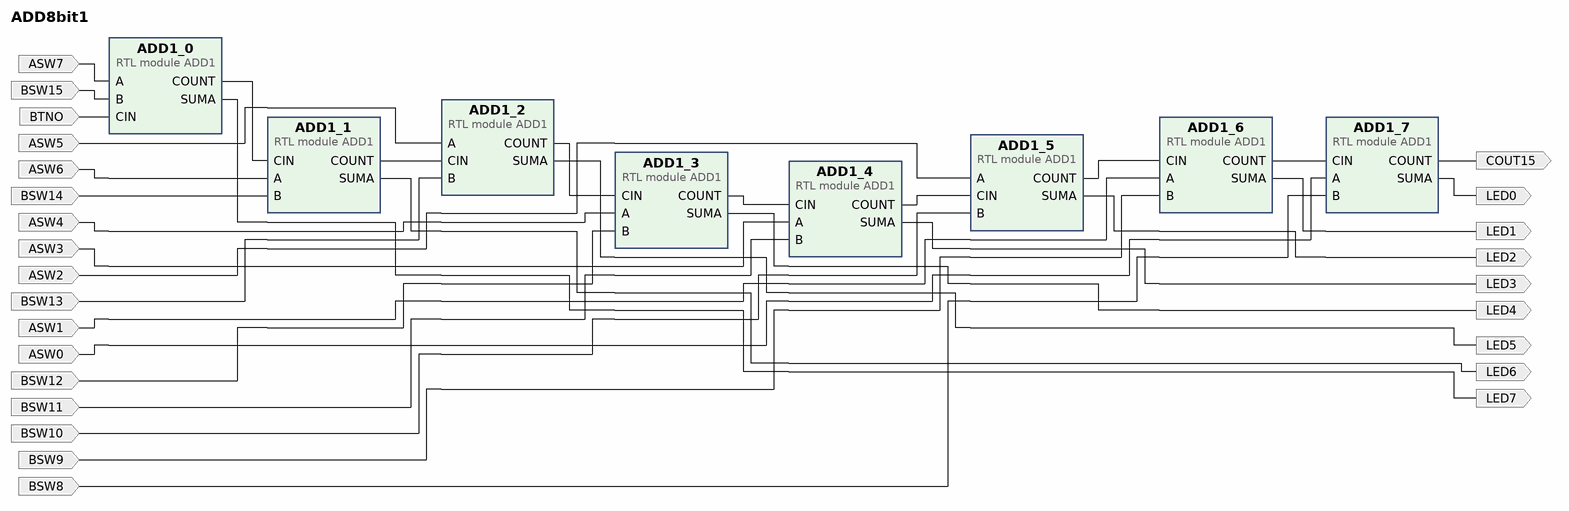
[diagram p0: block diagram of the top level]
# Vivado block design ADD8bit1, xc7a35tcpg236-1, Vivado 2020.1
create_bd_design ADD8bit1

create_bd_port -dir I ASW0
create_bd_port -dir I ASW1
create_bd_port -dir I ASW2
create_bd_port -dir I ASW3
create_bd_port -dir I ASW4
create_bd_port -dir I ASW5
create_bd_port -dir I ASW6
create_bd_port -dir I ASW7
create_bd_port -dir I BSW8
create_bd_port -dir I BSW9
create_bd_port -dir I BSW10
create_bd_port -dir I BSW11
create_bd_port -dir I BSW12
create_bd_port -dir I BSW13
create_bd_port -dir I BSW14
create_bd_port -dir I BSW15
create_bd_port -dir O LED0
create_bd_port -dir O LED1
create_bd_port -dir O LED2
create_bd_port -dir O LED3
create_bd_port -dir O LED4
create_bd_port -dir O LED5
create_bd_port -dir O LED6
create_bd_port -dir O LED7
create_bd_port -dir O COUT15
create_bd_port -dir I BTNO

create_bd_cell -type module -reference ADD1 ADD1_0
create_bd_cell -type module -reference ADD1 ADD1_1
create_bd_cell -type module -reference ADD1 ADD1_2
create_bd_cell -type module -reference ADD1 ADD1_3
create_bd_cell -type module -reference ADD1 ADD1_4
create_bd_cell -type module -reference ADD1 ADD1_5
create_bd_cell -type module -reference ADD1 ADD1_6
create_bd_cell -type module -reference ADD1 ADD1_7

# ---- connections ----

connect_bd_net -net ASW7_1 [get_bd_ports ASW7] [get_bd_pins ADD1_0/A]
connect_bd_net -net ASW6_1 [get_bd_ports ASW6] [get_bd_pins ADD1_1/A]
connect_bd_net -net ASW5_1 [get_bd_ports ASW5] [get_bd_pins ADD1_2/A]
connect_bd_net -net ASW4_1 [get_bd_ports ASW4] [get_bd_pins ADD1_3/A]
connect_bd_net -net ASW3_1 [get_bd_ports ASW3] [get_bd_pins ADD1_4/A]
connect_bd_net -net ASW2_1 [get_bd_ports ASW2] [get_bd_pins ADD1_5/A]
connect_bd_net -net ASW1_1 [get_bd_ports ASW1] [get_bd_pins ADD1_6/A]
connect_bd_net -net ASW0_1 [get_bd_ports ASW0] [get_bd_pins ADD1_7/A]
connect_bd_net -net BSW15_1 [get_bd_ports BSW15] [get_bd_pins ADD1_0/B]
connect_bd_net -net BSW14_1 [get_bd_ports BSW14] [get_bd_pins ADD1_1/B]
connect_bd_net [get_bd_pins ADD1_0/COUNT] [get_bd_pins ADD1_1/CIN]
connect_bd_net -net BSW13_1 [get_bd_ports BSW13] [get_bd_pins ADD1_2/B]
connect_bd_net -net BSW12_1 [get_bd_ports BSW12] [get_bd_pins ADD1_3/B]
connect_bd_net -net BSW11_1 [get_bd_ports BSW11] [get_bd_pins ADD1_4/B]
connect_bd_net -net BSW10_1 [get_bd_ports BSW10] [get_bd_pins ADD1_5/B]
connect_bd_net -net BSW9_1 [get_bd_ports BSW9] [get_bd_pins ADD1_6/B]
connect_bd_net -net BSW8_1 [get_bd_ports BSW8] [get_bd_pins ADD1_7/B]
connect_bd_net [get_bd_pins ADD1_7/SUMA] [get_bd_ports LED0]
connect_bd_net [get_bd_pins ADD1_6/COUNT] [get_bd_pins ADD1_7/CIN]
connect_bd_net [get_bd_pins ADD1_5/COUNT] [get_bd_pins ADD1_6/CIN]
connect_bd_net [get_bd_pins ADD1_1/COUNT] [get_bd_pins ADD1_2/CIN]
connect_bd_net [get_bd_pins ADD1_2/COUNT] [get_bd_pins ADD1_3/CIN]
connect_bd_net [get_bd_pins ADD1_3/COUNT] [get_bd_pins ADD1_4/CIN]
connect_bd_net [get_bd_pins ADD1_4/COUNT] [get_bd_pins ADD1_5/CIN]
connect_bd_net [get_bd_pins ADD1_6/SUMA] [get_bd_ports LED1]
connect_bd_net [get_bd_pins ADD1_5/SUMA] [get_bd_ports LED2]
connect_bd_net [get_bd_pins ADD1_4/SUMA] [get_bd_ports LED3]
connect_bd_net [get_bd_pins ADD1_3/SUMA] [get_bd_ports LED4]
connect_bd_net [get_bd_pins ADD1_2/SUMA] [get_bd_ports LED5]
connect_bd_net [get_bd_pins ADD1_7/COUNT] [get_bd_ports COUT15]
connect_bd_net [get_bd_pins ADD1_1/SUMA] [get_bd_ports LED6]
connect_bd_net [get_bd_pins ADD1_0/SUMA] [get_bd_ports LED7]
connect_bd_net [get_bd_ports BTNO] [get_bd_pins ADD1_0/CIN]

validate_bd_design
save_bd_design
